# Altium project ESP32-SIM800C.PrjPCB
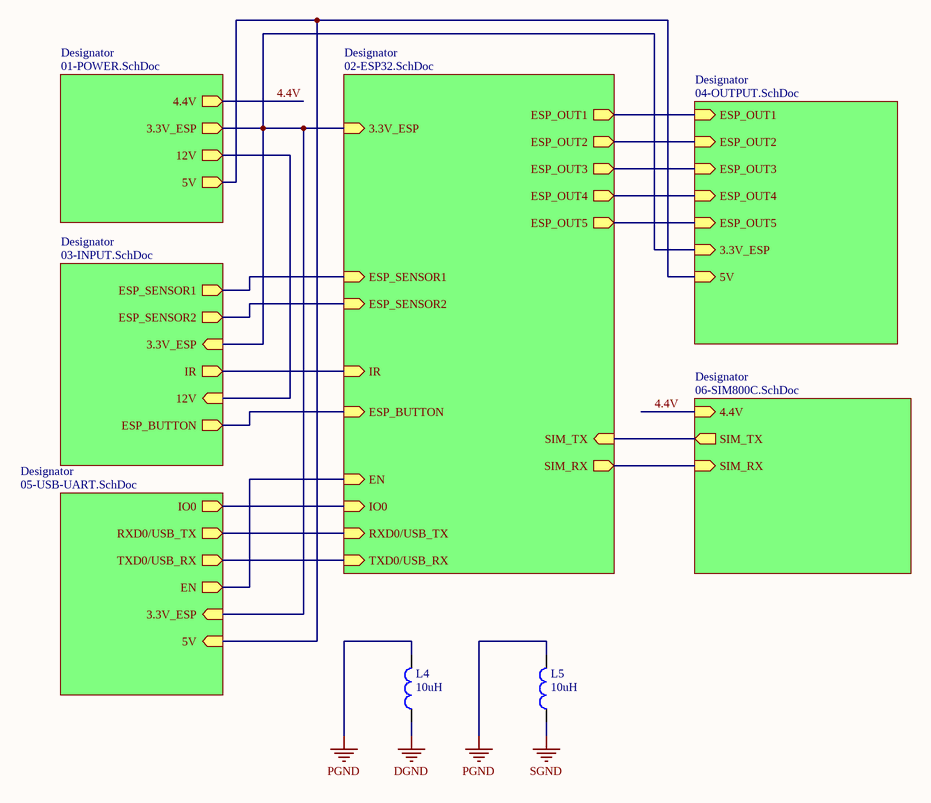
[diagram p0: Sheet1.SchDoc]
4 sheets, 66 parts. Net scope: flat (ports and power ports of the same name join across sheets).
Board file: ESP32-SIM800C.PcbDoc
Sheets:
  Sheet1.SchDoc
    Designator = 04-OUTPUT.SchDoc
    Designator = 06-SIM800C.SchDoc
    Designator = 05-USB-UART.SchDoc

## Sheet Sheet1.SchDoc
size A; SheetNumber: 1; SheetTotal: 7

### Parts
L4  10uH  [L 2520mm]
L5  10uH  [L 2520mm]

### Sub-sheets
Designator = 03-INPUT.SchDoc (file not in this document): ESP_SENSOR1 (out), ESP_SENSOR2 (out), ESP_BUTTON (out), IR (out), 3.3V_ESP (in), 12V (in)
Designator = 02-ESP32.SchDoc (file not in this document): 3.3V_ESP (in), ESP_SENSOR1 (in), ESP_SENSOR2 (in), ESP_BUTTON (in), ESP_OUT1 (out), ESP_OUT2 (out), ESP_OUT3 (out), ESP_OUT4 (out), ESP_OUT5 (out), RXD0/USB_TX (in), TXD0/USB_RX (in), SIM_TX (in), SIM_RX (out), IR (in), IO0 (in), EN (in)
Designator = 01-POWER.SchDoc (file not in this document): 4.4V (out), 3.3V_ESP (out), 12V (out), 5V (out)
Designator = 04-OUTPUT.SchDoc: ESP_OUT1 (in), ESP_OUT2 (in), ESP_OUT3 (in), ESP_OUT4 (in), ESP_OUT5 (in), 3.3V_ESP (in), 5V (in)
Designator = 06-SIM800C.SchDoc: SIM_RX (in), SIM_TX (out), 4.4V (in)
Designator = 05-USB-UART.SchDoc: RXD0/USB_TX (out), TXD0/USB_RX (out), IO0 (out), EN (out), 3.3V_ESP (in), 5V (in)

### Nets
DGND: L4.1
PGND: L4.2 L5.2
SGND: L5.1
4.4V: sheet Designator/4.4V, sheet Designator/4.4V
(unnamed): sheet Designator/ESP_SENSOR1, sheet Designator/ESP_SENSOR1
(unnamed): sheet Designator/ESP_SENSOR2, sheet Designator/ESP_SENSOR2
(unnamed): sheet Designator/ESP_BUTTON, sheet Designator/ESP_BUTTON
(unnamed): sheet Designator/IR, sheet Designator/IR
(unnamed): sheet Designator/3.3V_ESP, sheet Designator/3.3V_ESP, sheet Designator/3.3V_ESP, sheet Designator/3.3V_ESP, sheet Designator/3.3V_ESP
(unnamed): sheet Designator/12V, sheet Designator/12V
(unnamed): sheet Designator/ESP_OUT1, sheet Designator/ESP_OUT1
(unnamed): sheet Designator/ESP_OUT2, sheet Designator/ESP_OUT2
(unnamed): sheet Designator/ESP_OUT3, sheet Designator/ESP_OUT3
(unnamed): sheet Designator/ESP_OUT4, sheet Designator/ESP_OUT4
(unnamed): sheet Designator/ESP_OUT5, sheet Designator/ESP_OUT5
(unnamed): sheet Designator/RXD0/USB_TX, sheet Designator/RXD0/USB_TX
(unnamed): sheet Designator/TXD0/USB_RX, sheet Designator/TXD0/USB_RX
(unnamed): sheet Designator/SIM_TX, sheet Designator/SIM_TX
(unnamed): sheet Designator/SIM_RX, sheet Designator/SIM_RX
(unnamed): sheet Designator/IO0, sheet Designator/IO0
(unnamed): sheet Designator/EN, sheet Designator/EN
(unnamed): sheet Designator/5V, sheet Designator/5V, sheet Designator/5V

### Library data of the parts
L4 L5 = L1: Inductor; Value: 150 mH

## Sheet 04-OUTPUT.SchDoc: *OUTPUT
size A; SheetNumber: 5; SheetTotal: 7
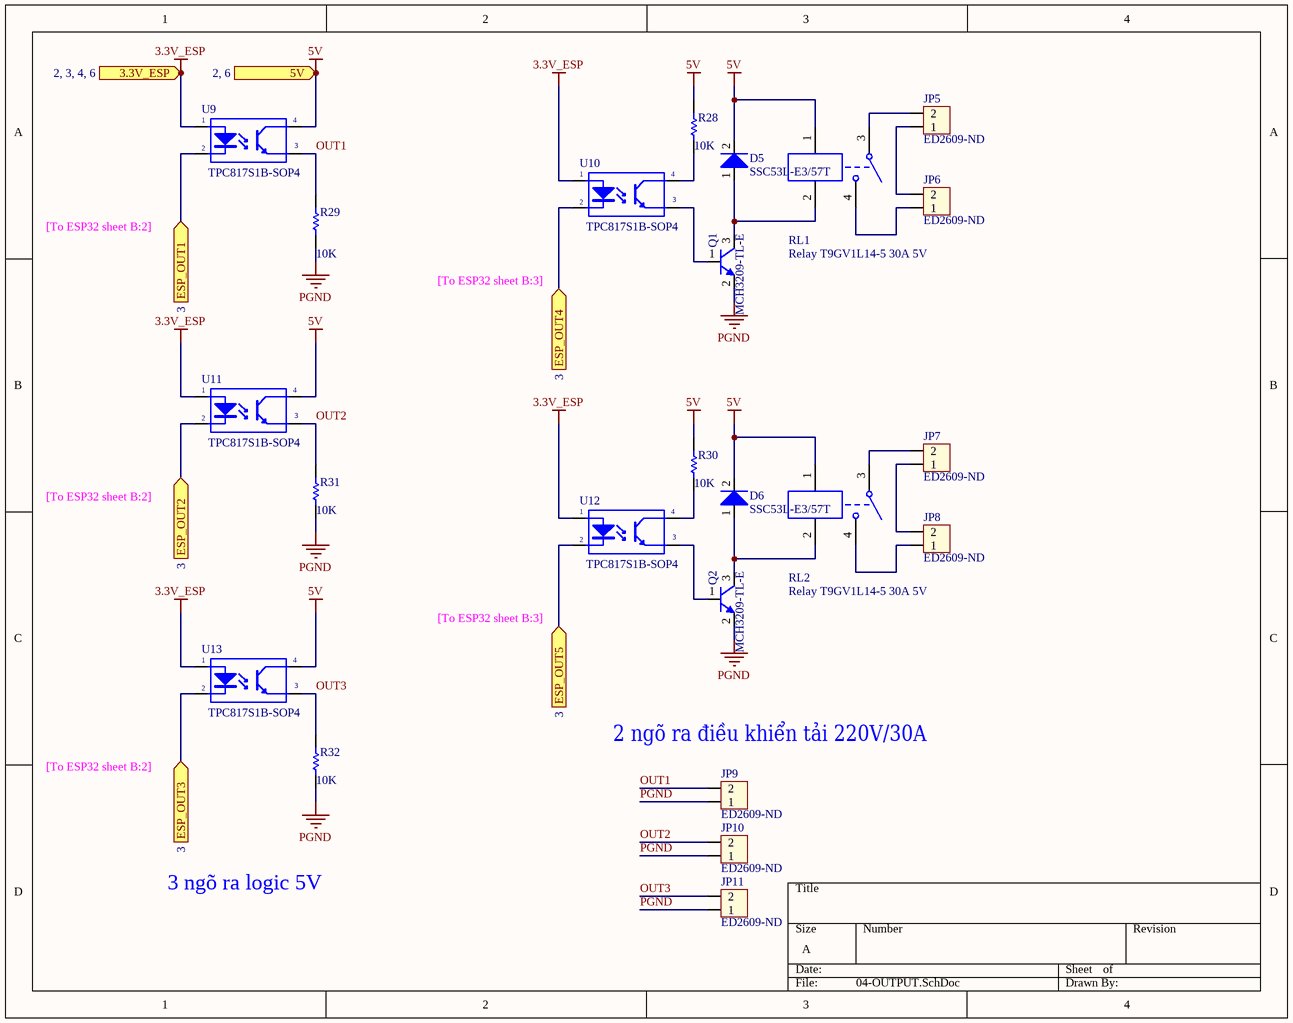
[diagram p1: 04-OUTPUT.SchDoc]

### Parts
D5  SSC53L-E3/57T  [SSC53L-E3/57T]
D6  SSC53L-E3/57T  [SSC53L-E3/57T]
JP5  ED2609-ND  [DOMINO_OSTTC_2P]
JP6  ED2609-ND  [DOMINO_OSTTC_2P]
JP7  ED2609-ND  [DOMINO_OSTTC_2P]
JP8  ED2609-ND  [DOMINO_OSTTC_2P]
JP9  ED2609-ND  [DOMINO_OSTTC_2P]
JP10  ED2609-ND  [DOMINO_OSTTC_2P]
JP11  ED2609-ND  [DOMINO_OSTTC_2P]
Q1  MCH3209-TL-E  [MCH3209-TL-E  SOT-323]
Q2  MCH3209-TL-E  [MCH3209-TL-E  SOT-323]
R28  10K  [Res 0805 SMD]
R29  10K  [Res 0805 SMD]
R30  10K  [Res 0805 SMD]
R31  10K  [Res 0805 SMD]
R32  10K  [Res 0805 SMD]
RL1  Relay T9GV1L14-5 30A 5V  [Relay T9GV1L14-5 30A 5V]
RL2  Relay T9GV1L14-5 30A 5V  [Relay T9GV1L14-5 30A 5V]
U9  TPC817S1B-SOP4  [TPC817-4SOP]
U10  TPC817S1B-SOP4  [TPC817-4SOP]
U11  TPC817S1B-SOP4  [TPC817-4SOP]
U12  TPC817S1B-SOP4  [TPC817-4SOP]
U13  TPC817S1B-SOP4  [TPC817-4SOP]

### Ports
3.3V_ESP (in, see 2, 3, 4, 6), 5V (in, see 2, 6), ESP_OUT1 (in, see 3), ESP_OUT2 (in, see 3), ESP_OUT3 (in, see 3), ESP_OUT4 (in, see 3), ESP_OUT5 (in, see 3)

### Nets
3.3V_ESP: U9.1(A) U10.1(A) U11.1(A) U12.1(A) U13.1(A) ; port 3.3V_ESP
5V: D5.2(K) D6.2(K) R28.2 R30.2 RL1.1 RL2.1 U9.4(C) U11.4(C) U13.4(C) ; port 5V
PGND: JP9.1 JP10.1 JP11.1 Q1.2(E) Q2.2(E) R29.1 R31.1 R32.1
OUT1: JP9.2 R29.2 U9.3(E)
OUT2: JP10.2 R31.2 U11.3(E)
OUT3: JP11.2 R32.2 U13.3(E)
NetD5_1: D5.1(A) Q1.3(C) RL1.2
NetD6_1: D6.1(A) Q2.3(C) RL2.2
NetJP5_1: JP5.1 JP6.2
NetJP5_2: JP5.2 RL1.3
NetJP6_1: JP6.1 RL1.4
NetJP7_1: JP7.1 JP8.2
NetJP7_2: JP7.2 RL2.3
NetJP8_1: JP8.1 RL2.4
NetQ1_1: Q1.1(B) U10.3(E)
NetQ2_1: Q2.1(B) U12.3(E)
NetR28_1: R28.1 U10.4(C)
NetR30_1: R30.1 U12.4(C)
NetU9_2: U9.2(K) ; port ESP_OUT1
NetU10_2: U10.2(K) ; port ESP_OUT4
NetU11_2: U11.2(K) ; port ESP_OUT2
NetU12_2: U12.2(K) ; port ESP_OUT5
NetU13_2: U13.2(K) ; port ESP_OUT3

### Notes on the sheet
- [To ESP32 sheet B:2]
- [To ESP32 sheet B:3]
- (near JP9) 2 ngõ ra điều khiển tải 220V/30A
- 3 ngõ ra logic 5V

### Library data of the parts
D5 D6 = 10A10: DIODE SCHOTTKY 30V 5A DO214AB; ComponentLink1Description: Datasheet; ComponentLink1URL: D:\Dropbox\Datasheets\Diodes and Rectifiers\Diodes\10AXX.pdf; Digikey: SSC53L-E3/57TGICT-ND
JP5-JP11 = Con2: 2 Position Wire to Board Terminal Block Horizontal with Board 0.200" (5.08mm) Through Hole; Value: Connector 2; Digikey: ED2609-ND
Q1 Q2 = 2SC1815: Bipolar (BJT) Transistor NPN 30V 3A 450MHz 800mW Surface Mount 3-MCPH; ComponentLink1Description: Datasheet; ComponentLink1URL: D:\Dropbox\Datasheets\Transistors\P Channel Bipolar\2SC1815.pdf; Digikey: MCH3209-TL-EOSCT-ND
R28-R32 = 249K/R0805/1%: RES SMD 249K OHM 1% 1/10W 0805; Manufacturer: Yageo; Manufacturer Part Number: RC0603FR-07249KL; Power (Watts): 0.1W, 1/10W; Temperature Coefficient: ±100ppm/°C; Supplier 1: Digi-Key; RoHS: RoHS Compliant; Category: Resistors; Stock 1: 370515; Pricing 1: 1=0.1, 10=0.015, 100=0.006, 1000=0.00268, 2500=0.00233 (USD); Packaging: Cut Tape (CT); Part Status: Active; Tolerance: ±1%; Composition: Thick Film; Features: Moisture Resistant; Operating Temperature: -55°C ~ 155°C; Package / Case: 0603 (1608 Metric); Supplier Device Package: 0603; Size / Dimension: 0.063" L x 0.032" W (1.60mm x 0.80mm); Height - Seated (Max): 0.022" (0.55mm); Failure Rate: -; ComponentLink1URL: http://www.yageo.com/documents/recent/PYu-RC_Group_51_RoHS_L_8.pdf; ComponentLink1Description: http://www.yageo.com/documents/recent/PYu-RC_Group_51_RoHS_L_8.pdf
RL1 RL2 = Relay T9GV1L14-5 30A 5V: General Purpose Relay SPST-NO (1 Form A) 5VDC Coil Through Hole; Digikey: T9GV1L14-5
U9-U13 = PC817: Optoisolator Transistor Output 5000Vrms 1 Channel 4-SOP; Digikey: TPC817S1BRAGCT-ND

## Sheet 06-SIM800C.SchDoc: *MODUL SIM800
size A3; SheetNumber: 7; SheetTotal: 7
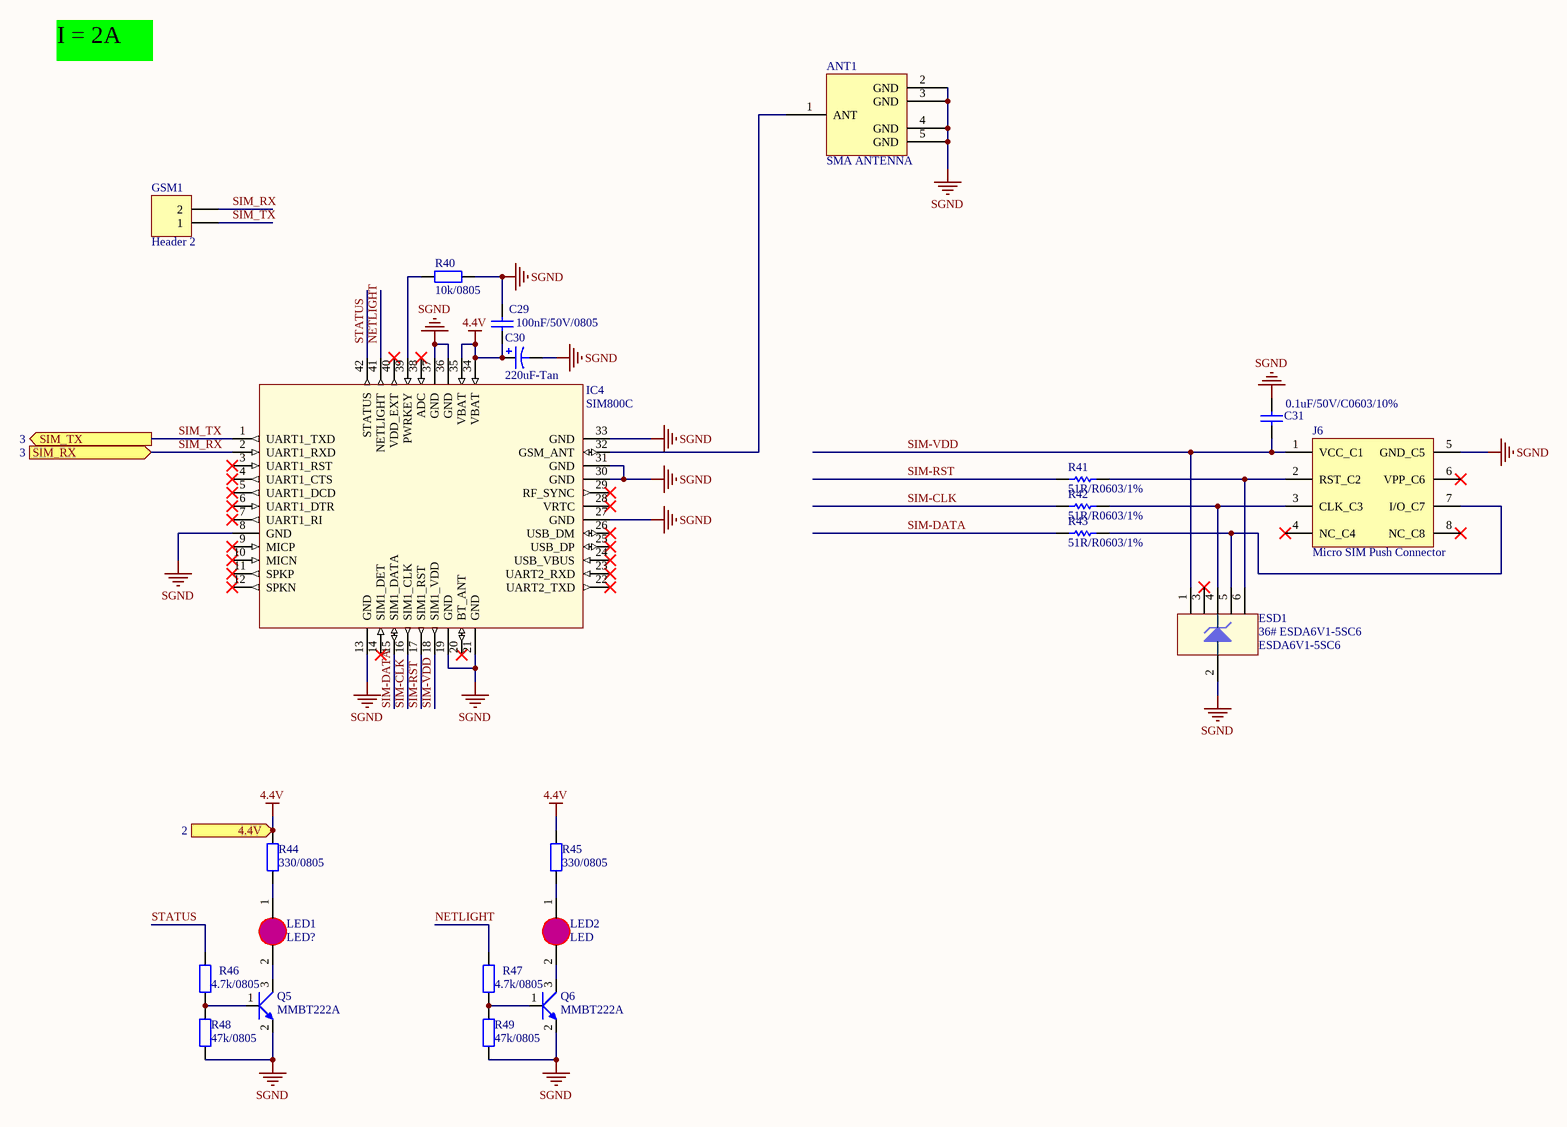
[diagram p2: 06-SIM800C.SchDoc]

### Parts
ANT1  SMA ANTENNA  [ANT-SMA-ST-F]
C29  100nF/50V/0805  [Cap Ceramic 0805 SMD]
C30  220uF-Tan  [CAP TANT CASE E SMD]
C31  0.1uF/50V/C0603/10%  [Cap Ceramic 0603 SMD]
ESD1  36# ESDA6V1-5SC6  Supplier Part Number 1: ESDA6V1-5SC6  [36# ESDA6V1-5SC6]
GSM1  Header 2  [Header_2]
IC4  SIM800C  [SIM800C]
J6  Micro SIM Push Connector  [9# SIM holder]
LED1  LED?  [Led 0805R]
LED2  LED  [Led 0805R]
Q5  MMBT222A  [MMBT2222A]
Q6  MMBT222A  [MMBT2222A]
R40  10k/0805  [RESC2012(0805)]
R41  51R/R0603/1%  [Res 0603 SMD]
R42  51R/R0603/1%  [Res 0603 SMD]
R43  51R/R0603/1%  [Res 0603 SMD]
R44  value 330/0805  [RESC2012(0805)]  (hidden comment: R0805)
R45  value 330/0805  [RESC2012(0805)]  (hidden comment: R0805)
R46  value 4.7k/0805  [RESC2012(0805)]  (hidden comment: R0805)
R47  value 4.7k/0805  [RESC2012(0805)]  (hidden comment: R0805)
R48  value 47k/0805  [RESC2012(0805)]  (hidden comment: R0805)
R49  value 47k/0805  [RESC2012(0805)]  (hidden comment: R0805)

### Ports
4.4V (in, see 2), SIM_RX (in, see 3), SIM_TX (out, see 3)

### Nets
4.4V: C29.1 C30.1 IC4.34(VBAT) IC4.35(VBAT) R44.1 R45.1 ; port 4.4V
SGND: ANT1.2(GND) ANT1.3(GND) ANT1.4(GND) ANT1.5(GND) C29.2 C30.2 C31.2 ESD1.2(GND) IC4.8(GND) IC4.13(GND) IC4.19(GND) IC4.21(GND) IC4.27(GND) IC4.30(GND) IC4.31(GND) IC4.33(GND) IC4.36(GND) IC4.37(GND) J6.5(GND_C5) Q5.2 Q6.2 R40.2 R48.2 R49.2
NETLIGHT: IC4.41(NETLIGHT) R47.1
SIM-CLK: IC4.16(SIM1_CLK) R42.1
SIM-DATA: IC4.15(SIM1_DATA) R43.1
SIM-RST: IC4.17(SIM1_RST) R41.1
SIM-VDD: C31.1 ESD1.1(IO1) IC4.18(SIM1_VDD) J6.1(VCC_C1)
SIM_RX: GSM1.2 IC4.2(UART1_RXD) ; port SIM_RX
SIM_TX: GSM1.1 IC4.1(UART1_TXD) ; port SIM_TX
STATUS: IC4.42(STATUS) R46.1
NetANT1_1: ANT1.1(ANT) IC4.32(GSM_ANT)
NetESD1_4: ESD1.4(IO3) J6.3(CLK_C3) R42.2
NetESD1_5: ESD1.5(IO4) J6.7(I/O_C7) R43.2
NetESD1_6: ESD1.6(IO5) J6.2(RST_C2) R41.2
NetIC4_39: IC4.39(PWRKEY) R40.1
NetLED1_1: LED1.1(A) R44.2
NetLED1_2: LED1.2(K) Q5.3
NetLED2_1: LED2.1(A) R45.2
NetLED2_2: LED2.2(K) Q6.3
NetQ5_1: Q5.1 R46.2 R48.1
NetQ6_1: Q6.1 R47.2 R49.1

Not connected (* = marked no-connect by the designer): ESD1 3(IO2)*; IC4 3(UART1_RST)* 4(UART1_CTS)* 5(UART1_DCD)* 6(UART1_DTR)* 7(UART1_RI)* 9(MICP)* 10(MICN)* 11(SPKP)* 12(SPKN)* 14(SIM1_DET)* 20(BT_ANT)* 22(UART2_TXD)* 23(UART2_RXD)* 24(USB_VBUS)* 25(USB_DP)* 26(USB_DM)* 28(VRTC)* 29(RF_SYNC)* 38(ADC)* 40(VDD_EXT)*; J6 4(NC_C4)* 6(VPP_C6)* 8(NC_C8)*

### Notes on the sheet
- I = 2A
- Title
- Size:
- Date:
- A3
- Number:
- Time:
- Revision:
- Sheet
- of
- File:

### Library data of the parts
C29 = CapSMD: Value: 33p; Published: 8-Jun-2000; LatestRevisionDate: 17-Jul-2002; LatestRevisionNote: Re-released for DXP Platform.; PackageReference: RAD-0.3; Publisher: Altium Limited
C30 = CAP1210-Tan
C31 = 0.1uF/50V/C0603/10%: CAP CER 0.1UF 50V 10% X7R 0603; Manufacturer: Murata Electronics North America; Manufacturer Part Number: GRM188R71H104KA93D; Capacitance: 0.1µF; RoHS: RoHS Compliant; Category: Capacitors; Packaging: Tape & Reel (TR); Tolerance: ±10%; Voltage - Rated: 50V; Temperature Coefficient: X7R; Mounting Type: Surface Mount, MLCC; Operating Temperature: -55°C ~ 125°C; Applications: General Purpose; Ratings: -; Package / Case: 0603 (1608 Metric); Size / Dimension: 0.063" L x 0.031" W (1.60mm x 0.80mm); Height - Seated (Max): -; Thickness (Max): 0.035" (0.90mm); Lead Spacing: -; Features: -; Lead Style: -; ComponentLink1URL: http://www.murata.com/~/media/webrenewal/support/library/catalog/products/capacitor/mlcc/c02e.ashx; ComponentLink1Description: http://www.murata.com/~/media/webrenewal/support/library/catalog/products/capacitor/mlcc/c02e.ashx; Supplier 1: Digi-Key; Supplier Part Number 1: 490-1519-1-ND
ESD1 = 36# ESDA6V1-5SC6: TRANSIL™ ARRAY FOR ESD PROTECTION; Supplier 1: Future Electronics
GSM1 = Header 2: Header, 2-Pin; LatestRevisionDate: 17-Jul-2002; LatestRevisionNote: Re-released for DXP Platform.; Publisher: Altium Limited
IC4 = SIM800C: SIM800C V1.00
J6 = 9#SIM Card Holder KF-016: https://www.alibaba.com/product-detail/Micro-SIM-Push-Connector-SIM-Card_60749325624.html?spm=a2700.7724838.2017115.23.25ee5ac4b0uZwo
LED1 LED2 = LED0805: LED SMD 0805
R40 R44-R49 = R0805: Resistor SMD 0805; Published: 8-Jun-2000; LatestRevisionDate: 17-Jul-2002; LatestRevisionNote: Re-released for DXP Platform.; PackageReference: AXIAL-0.4; Publisher: Altium Limited
R41-R43 = 22R/R0603/1%: RES SMD 22 OHM 1% 1/10W 0603; Manufacturer: Yageo; Manufacturer Part Number: RC0603FR-0722RL; Resistance (Ohms): 22; Power (Watts): 0.1W, 1/10W; Temperature Coefficient: ±100ppm/°C; RoHS: RoHS Compliant; Category: Resistors; Packaging: Cut Tape (CT); Tolerance: ±1%; Composition: Thick Film; Features: Moisture Resistant; Operating Temperature: -55°C ~ 155°C; Package / Case: 0603 (1608 Metric); Supplier Device Package: 0603; Size / Dimension: 0.063" L x 0.031" W (1.60mm x 0.80mm); Height: 0.022" (0.55mm); Number of Terminations: 2; ComponentLink1URL: http://www.yageo.com/NewPortal/yageodocoutput?fileName=/pdf/R-Chip/PYu-RC_Group_51_RoHS_L_3.pdf; ComponentLink1Description: http://www.yageo.com/NewPortal/yageodocoutput?fileName=/pdf/R-Chip/PYu-RC_Group_51_RoHS_L_3.pdf; Supplier 1: Digi-Key; Supplier Part Number 1: 311-22.0HRCT-ND

## Sheet 05-USB-UART.SchDoc: *USBTOUART
size A3; SheetNumber: 6; SheetTotal: 7
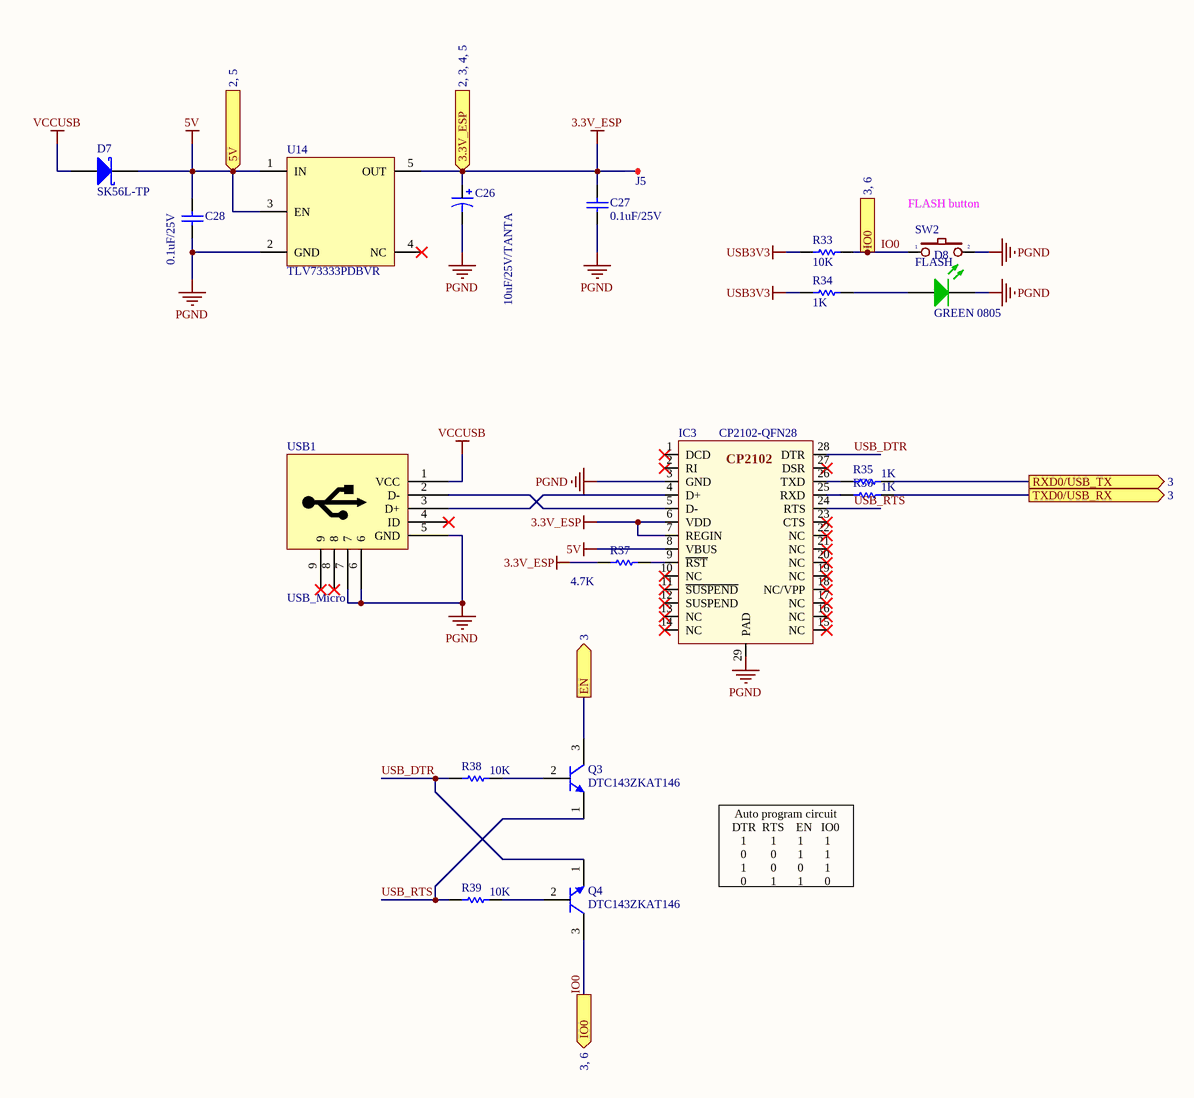
[diagram p3: 05-USB-UART.SchDoc]

### Parts
C26  10uF/25V/TANTA  [CAP TANT CASE B SMD]
C27  0.1uF/25V  [CAP_CERA_C2012(CC0805INCH)]
C28  0.1uF/25V  [CAP_CERA_C2012(CC0805INCH)]
D7  SK56L-TP  [30# SK56L-TPMSCT-ND]
D8  GREEN 0805  [Led 0805G]
IC3  CP2102-QFN28  [CP2102-QFN28]
J5  TEST POINT  [TEST POINT 1mm]  (value not drawn)
Q3  DTC143ZKAT146  [6# DTC143ZKAT146-E]
Q4  DTC143ZKAT146  [6# DTC143ZKAT146-E]
R33  10K  [Res 0805 SMD]
R34  1K  [Res 0805 SMD]
R35  1K  [Res 0805 SMD]
R36  1K  [Res 0805 SMD]
R37  4.7K  [Res 0805 SMD]
R38  10K  [Res 0805 SMD]
R39  10K  [Res 0805 SMD]
SW2  FLASH  [Button 3x4mm]
U14  TLV73333PDBVR  [20# TLV73333PDBVR]
USB1  USB_Micro  [USB_MICRO_B - Digikey]

### Ports
3.3V_ESP (in, see 2, 3, 4, 5), 5V (in, see 2, 5), EN (out, see 3), IO0 (out, see 3, 6), RXD0/USB_TX (out, see 3), TXD0/USB_RX (out, see 3)

### Nets
3.3V_ESP: C26.1 C27.2 IC3.6(VDD) IC3.7(REGIN) J5.1(TP) R37.1 U14.5(OUT) ; port 3.3V_ESP
5V: C28.2 D7.2(K) IC3.8(VBUS) U14.1(IN) U14.3(EN) ; port 5V
PGND: C26.2 C27.1 C28.1 D8.2(K) IC3.3(GND) IC3.29(PAD) SW2.2 U14.2(GND) USB1.5(GND) USB1.6 USB1.7
USB3V3: R33.1 R34.1
VCCUSB: D7.1(A) USB1.1(VCC)
IO0: Q4.3(C) R33.2 SW2.1 ; port IO0
USB_DTR: IC3.28(DTR) Q4.1(E) R38.2
USB_RTS: IC3.24(RTS) Q3.1(E) R39.2
NetD8_1: D8.1(A) R34.2
NetIC3_4: IC3.4(D+) USB1.3(D+)
NetIC3_5: IC3.5(D-) USB1.2(D-)
NetIC3_9: IC3.9(~{RST}) R37.2
NetIC3_25: IC3.25(RXD) R36.2
NetIC3_26: IC3.26(TXD) R35.2
NetQ3_2: Q3.2(B) R38.1
NetQ3_3: Q3.3(C) ; port EN
NetQ4_2: Q4.2(B) R39.1
NetR35_1: R35.1 ; port RXD0/USB_TX
NetR36_1: R36.1 ; port TXD0/USB_RX

Not connected (* = marked no-connect by the designer): IC3 1(DCD)* 2(RI)* 10(NC)* 11(~{SUSPEND})* 12(SUSPEND)* 13(NC)* 14(NC)* 15(NC)* 16(NC)* 17(NC)* 18(NC/VPP)* 19(NC)* 20(NC)* 21(NC)* 22(NC)* 23(CTS)* 27(DSR)*; U14 4(NC)*; USB1 4(ID)* 8* 9*

### Notes on the sheet
- (near SW2) FLASH button
- Auto program circuit
  DTR  RTS    EN   IO0
  1        1       1       1
  0        0       1       1
  1        0       0       1
  0        1       1       0
- Title
- Size:
- Date:
- A3
- Number:
- Time:
- Revision:
- Sheet
- of
- File:

### Library data of the parts
C26 = TAJB106M025RNJ: 10µF Molded Tantalum Capacitors 25V 1411 (3528 Metric) 3 Ohm; Manufacturer: KEMET; Digikey: 399-5125-1-ND
C27 = 0.1uF/50V/C0603/10%: 0.1µF ±10% 25V Ceramic Capacitor X7R 0805 (2012 Metric); Manufacturer: KEMET; ComponentLink1URL: http://www.murata.com/~/media/webrenewal/support/library/catalog/products/capacitor/mlcc/c02e.ashx; ComponentLink1Description: http://www.murata.com/~/media/webrenewal/support/library/catalog/products/capacitor/mlcc/c02e.ashx; Digikey: 478-3755-1-ND
C28 = 0.1uF/50V/C0603/10%: 0.1µF ±10% 25V Ceramic Capacitor X7R 0805 (2012 Metric); ComponentLink1URL: http://www.murata.com/~/media/webrenewal/support/library/catalog/products/capacitor/mlcc/c02e.ashx; ComponentLink1Description: http://www.murata.com/~/media/webrenewal/support/library/catalog/products/capacitor/mlcc/c02e.ashx; Digikey: 478-3755-1-ND
D7 = 30# SK56L-TP: DIODE SCHOTTKY 60V 5A DO214AB; ComponentLink1URL: http://www.mccsemi.com/up_pdf/SK52L-SK510L(DO-214AB).PDF; ComponentLink1Description: http://www.mccsemi.com/up_pdf/SK52L-SK510L(DO-214AB).PDF; Digikey: SK56L-TPMSCT-ND
D8 = LED GREEN 0603: Green 571nm LED Indication - Discrete 2V 0805 (2012 Metric); ComponentLink1URL: http://optoelectronics.liteon.com/upload/download/DS22-2000-074/S_110_LTST-C190KGKT.pdf; ComponentLink1Description: http://optoelectronics.liteon.com/upload/download/DS22-2000-074/S_110_LTST-C190KGKT.pdf; Digikey: 160-1426-1-ND
IC3 = CP2102: USB Bridge, USB to UART USB 2.0 UART Interface 28-QFN (5x5); Digikey: 336-3694-ND; VNBuy: https://banlinhkien.vn/goods-2607-cp2102-qfn28.html
J5 = PAD 1mm: TPoint
Q3 Q4 = 6#DTC143ZKAT146: Pre-Biased Bipolar Transistor (BJT) NPN - Pre-Biased 50V 100mA 250MHz 200mW Surface Mount SMT3; Digikey: DTC143ZKAT146CT-ND
R33 = 200K/R0603/1%: 10 kOhms ±1% 0.125W, 1/8W Chip Resistor 0805 (2012 Metric) Thick Film; Power (Watts): 0.1W, 1/10W; RoHS: RoHS Compliant; Category: Resistors; Part Status: Active; Features: Moisture Resistant; Operating Temperature: -55°C ~ 155°C; Package / Case: 0603 (1608 Metric); Supplier Device Package: 0603; Size / Dimension: 0.063" L x 0.031" W (1.60mm x 0.80mm); Height - Seated (Max): 0.022" (0.55mm); Failure Rate: -; ComponentLink1URL: http://www.yageo.com/documents/recent/PYu-RC_Group_51_RoHS_L_7.pdf; ComponentLink1Description: http://www.yageo.com/documents/recent/PYu-RC_Group_51_RoHS_L_7.pdf; Digikey: A126332CT-ND
R34 = 200K/R0603/1%: 1 kOhms ±1% 0.125W, 1/8W Chip Resistor 0805 (2012 Metric) Automotive AEC-Q200 Thick Film; Power (Watts): 0.1W, 1/10W; RoHS: RoHS Compliant; Category: Resistors; Part Status: Active; Features: Moisture Resistant; Operating Temperature: -55°C ~ 155°C; Package / Case: 0603 (1608 Metric); Supplier Device Package: 0603; Size / Dimension: 0.063" L x 0.031" W (1.60mm x 0.80mm); Height - Seated (Max): 0.022" (0.55mm); Failure Rate: -; ComponentLink1URL: http://www.yageo.com/documents/recent/PYu-RC_Group_51_RoHS_L_7.pdf; ComponentLink1Description: http://www.yageo.com/documents/recent/PYu-RC_Group_51_RoHS_L_7.pdf; Digikey: 541-1.00KCCT-ND
R35 R36 = 34.8K/R0805/1%: 1 kOhms ±1% 0.125W, 1/8W Chip Resistor 0805 (2012 Metric) Automotive AEC-Q200 Thick Film; Power Rating: 100mW; Resistance: 34.8kR; Voltage Rating: 50V; Case/Package: 0603; Case Code (Imperial): 0603; Case Code (Metric): 1608; Min Operating Temperature: -55°C; Max Operating Temperature: 155°C; Termination: SMD/SMT; Military Standard: Not; Voltage Rating (DC): 50V; Length: 1.6mm; Height: 0.45mm; Width: 0.8mm; Depth: 0.8mm; Lead Free: Lead Free; Digikey: 541-1.00KCCT-ND
R37 = 34.8K/R0805/1%: 4.7 kOhms ±1% 0.125W, 1/8W Chip Resistor 0805 (2012 Metric) Thick Film; Digikey: 541-4131-1-ND
R38 R39 = 34.8K/R0805/1%: 10 kOhms ±1% 0.125W, 1/8W Chip Resistor 0805 (2012 Metric) Thick Film; Power Rating: 100mW; Resistance: 34.8kR; Voltage Rating: 50V; Case/Package: 0603; Case Code (Imperial): 0603; Case Code (Metric): 1608; Min Operating Temperature: -55°C; Max Operating Temperature: 155°C; Termination: SMD/SMT; Military Standard: Not; Voltage Rating (DC): 50V; Length: 1.6mm; Height: 0.45mm; Width: 0.8mm; Depth: 0.8mm; Lead Free: Lead Free; Digikey: A126332CT-ND
SW2 = SW2: SWITCH TACTILE SPST-NO 0.05A 12V; Digikey: CKN10384CT-ND
U14 = 20#TLV73333PDBVR: Linear Voltage Regulator IC Positive Fixed 1 Output 3.3V 300mA SOT-23-5; Digikey: 296-40673-1-ND
USB1 = USB_MINI: USB - micro B USB 2.0 Receptacle Connector 5 Position Surface Mount, Right Angle; Through Hole; BuyVN: https://banlinhkien.vn/goods-5145-microusb-mk5p-dip.html; Digikey: 609-4618-1-ND

## Nets that join several sheets
3.3V_ESP: 04-OUTPUT (5 pins), 05-USB-UART (7 pins)
5V: 04-OUTPUT (9 pins), 05-USB-UART (5 pins)
PGND: Sheet1 (L4.2 L5.2), 04-OUTPUT (8 pins), 05-USB-UART (11 pins)
SGND: Sheet1 (L5.1), 06-SIM800C (24 pins)